# Altium schematic sheet RotationACQ.SchDoc: RotationACQ
size A4; Author: Joao Guimaraes; Organization: Altium Limited; Address1: L3, 12a Rodborough Rd; Address2: Frenchs Forest; Address3: NSW; Address4: Australia 2086; Revision: 1.0.0
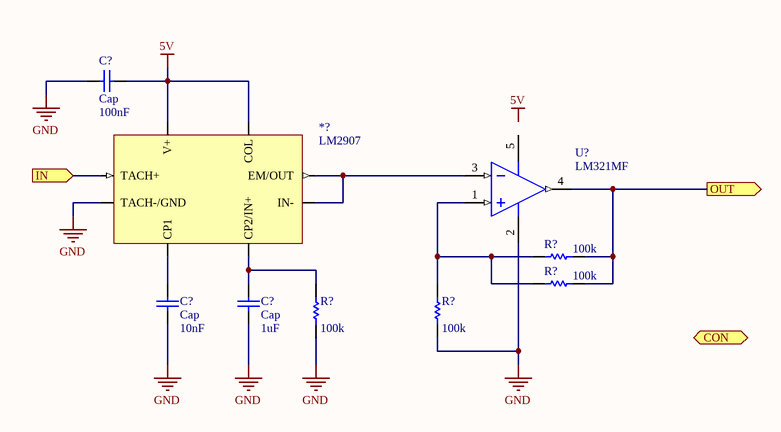
[diagram p0: RotationACQ.SchDoc]

## Parts
(Parts that share a designator on the sheet are numbered #1, #2 ... from top to bottom, then left to right.)
*?  LM2907  [DIP-8]
C?#1  Cap  value 100nF  [0603]
C?#2  Cap  value 10nF  [0603]
C?#3  Cap  value 1uF  [0603]
R?#1  value 100k  [6-0805_M]
R?#2  value 100k  [6-0805_M]
R?#3  value 100k  [6-0805_M]
R?#4  value 100k  [6-0805_M]
U?  LM321MF  [SOT95P285X120-5N]

## Ports
CON (out), IN (in), OUT (out)

## Nets
5V: *?.5(COL) *?.6(V+) C?#1.1
GND: *?.8(TACH-/GND) C?#1.2 C?#2.1 C?#3.1 R?#3.2 R?#4.2 U?.2(V-)
IN: *?.1(TACH+) ; port IN
OUT: R?#1.2 R?#2.2 U?.4(Out) ; port OUT
Net*?_2: *?.2(CP1) C?#2.2
Net*?_3: *?.3(CP2/IN+) C?#3.2 R?#3.1
Net*?_4: *?.4(EM/OUT) *?.5(IN-) U?.3(IN-)
NetR?#1_1: R?#1.1 R?#2.1 R?#4.1 U?.1(IN+)

Not connected (* = marked no-connect by the designer): U? 5(V+)

## Notes on the sheet
- Labels drawn without touching a wire or pin: 5V
- Title:
- Project:
- Date:
- Author:
- Version:
- File:

## Library data of the parts
C?#1-C?#3 = Cap: Capacitor; Published: 8-Jun-2000; LatestRevisionDate: 17-Jul-2002; LatestRevisionNote: Re-released for DXP Platform.; PackageReference: RAD-0.3; Publisher: Altium Limited; PackageDescription: Radial Cap, Thru-Hole; 2 Leads; 0.3 in Pin Spacing
R?#1-R?#4 = Res1: Resistor; Published: 8-Jun-2000; LatestRevisionDate: 17-Jul-2002; LatestRevisionNote: Re-released for DXP Platform.; PackageReference: AXIAL-0.3; Publisher: Altium Limited; PackageDescription: Axial Device, Thru-Hole; 2 Leads; 0.3 in Pin Spacing
U? = LM321MF: Low Power Single Rail-To-Rail OpAMp; Published: 8-Jun-2000; LatestRevisionDate: 17-Jul-2002; LatestRevisionNote: Re-released for DXP Platform.; DatasheetVersion: REV. B; PackageVersion: 1990; PackageReference: H-08A; Publisher: Altium Limited; PackageDescription: Can; 8 Leads; Pin Circle Dia. 5.08 mm; Lead Dia. 0.53 mm (max); ComponentLink1Description: Manufacturer Link; ComponentLink1URL: http://www.analog.com/